# EAGLE schematic LauriFilter-R2 (EAGLE 6.5.0)
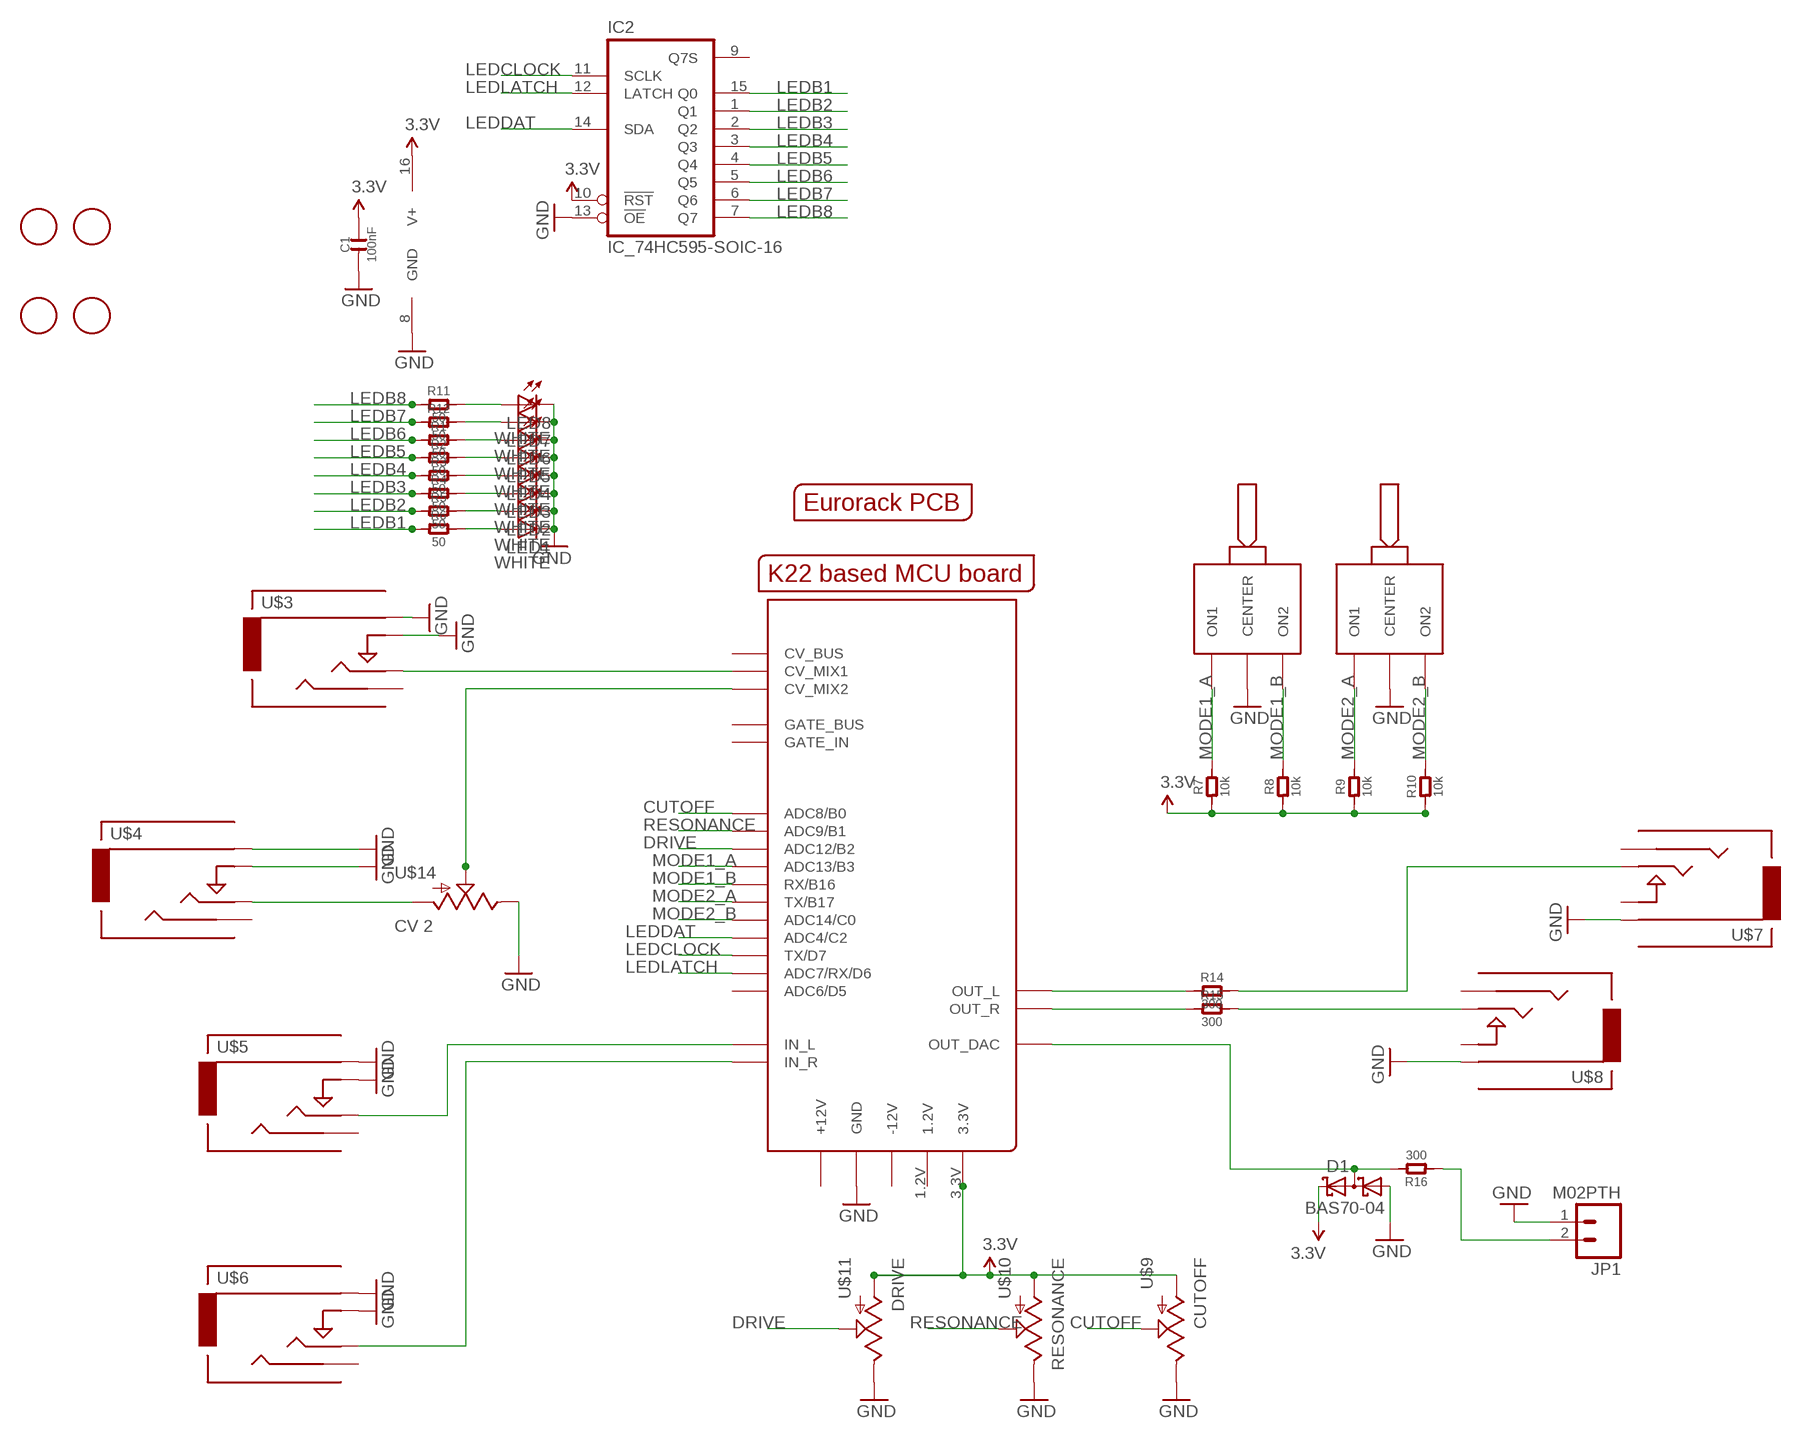
[diagram p0: schematic, sheet 1]

## Parts
C1  100nF  C-0603  [C0603]
D1  BAS70-04  [SOT23]
IC2  IC_74HC595-SOIC-16  [SOIC-16]
JP1  M02PTH  [1X02]
LED1  WHITE  LED3MM  [LED3MM]
LED2  WHITE  LED3MM  [LED3MM]
LED3  WHITE  LED3MM  [LED3MM]
LED4  WHITE  LED3MM  [LED3MM]
LED5  WHITE  LED3MM  [LED3MM]
LED6  WHITE  LED3MM  [LED3MM]
LED7  WHITE  LED3MM  [LED3MM]
LED8  WHITE  LED3MM  [LED3MM]
R1  50  R-0603  [R0603]
R2  50  R-0603  [R0603]
R3  50  R-0603  [R0603]
R4  50  R-0603  [R0603]
R5  50  R-0603  [R0603]
R6  50  R-0603  [R0603]
R7  10k  R-0603  [R0603]
R8  10k  R-0603  [R0603]
R9  10k  R-0603  [R0603]
R10  10k  R-0603  [R0603]
R11  50  R-0603  [R0603]
R12  50  R-0603  [R0603]
R14  300  R  [C0805]
R15  300  R  [C0805]
R16  300  R-0603  [R0603]
U$1  MCUBOARD  [MCUBASEBOARD]
U$2  EURORACK_PCB8HP  [EURORACK8HPPCB]
U$3  CV 1  AUDIO-JACKINPUT  [3.5MM-JACK-SWITCH-13MM-INPUT]
U$4  CV 2  AUDIO-JACKINPUT  [3.5MM-JACK-SWITCH-13MM-INPUT]
U$5  IN 1  AUDIO-JACKINPUT  [3.5MM-JACK-SWITCH-13MM-INPUT]
U$6  IN 2  AUDIO-JACKINPUT  [3.5MM-JACK-SWITCH-13MM-INPUT]
U$7  OUT 1  AUDIO-JACKOUTPUT  [3.5MM-JACK-SWITCH-13MM-OUTPUT]
U$8  OUT 2  AUDIO-JACKOUTPUT  [3.5MM-JACK-SWITCH-13MM-OUTPUT]
U$9  CUTOFF  POTZEPHPOT  [OG-POTS_ALPS_POT_VERTICAL]
U$10  RESONANCE  POTZEPHPOT  [OG-POTS_ALPS_POT_VERTICAL]
U$11  DRIVE  POTZEPHPOT  [OG-POTS_ALPS_POT_VERTICAL]
U$12  ONOFFON  [MULTICOMP1MS-ONOFFON]
U$13  ONOFFON  [MULTICOMP1MS-ONOFFON]
U$14  CV 2  POTZEPHPOT  [OG-POTS_ALPS_POT_VERTICAL]
U$15  FIDUCIAL  [FIDUCIAL_1MM]
U$16  FIDUCIAL  [FIDUCIAL_1MM]
U$17  FIDUCIAL  [FIDUCIAL_1MM]
U$18  FIDUCIAL  [FIDUCIAL_1MM]

## Nets
3.3V: C1.2 D1.2(C2) IC2.10(!RST) IC2.16(V+) R7.1 R8.1 R9.1 R10.1 U$1.3.3V U$9.P$3(A) U$10.P$3(A) U$11.P$3(A)
CUTOFF: U$1.ADC8(ADC8/B0) U$9.P$2(S)
DRIVE: U$1.ADC12(ADC12/B2) U$11.P$2(S)
GND: C1.1 D1.1(A1) IC2.8(GND) IC2.13(!OE) JP1.1 LED1.K(C) LED2.K(C) LED3.K(C) LED4.K(C) LED5.K(C) LED6.K(C) LED7.K(C) LED8.K(C) U$1.GND@1(GND) U$1.GND@2(GND) U$1.GND@4(GND) U$1.GND@5(GND) U$1.GND@6(GND) U$1.GND@7(GND) U$1.GND@8(GND) U$1.GND@9(GND) U$1.GND_BUS(GND) U$3.RING@1(RING) U$3.RING@2(RING) U$3.SWITCH@1(SWITCH) U$3.SWITCH@2(SWITCH) U$4.RING@1(RING) U$4.RING@2(RING) U$4.SWITCH@1(SWITCH) U$4.SWITCH@2(SWITCH) U$5.RING@1(RING) U$5.RING@2(RING) U$5.SWITCH@1(SWITCH) U$5.SWITCH@2(SWITCH) U$6.RING@1(RING) U$6.RING@2(RING) U$6.SWITCH@1(SWITCH) U$6.SWITCH@2(SWITCH) U$7.RING@1(RING) U$7.RING@2(RING) U$8.RING@1(RING) U$8.RING@2(RING) U$9.P$1(E) U$10.P$1(E) U$11.P$1(E) U$12.2(CENTER) U$13.2(CENTER) U$14.P$1(E)
LEDB1: IC2.15(Q0) R6.1
LEDB2: IC2.1(Q1) R5.1
LEDB3: IC2.2(Q2) R4.1
LEDB4: IC2.3(Q3) R3.1
LEDB5: IC2.4(Q4) R2.1
LEDB6: IC2.5(Q5) R1.1
LEDB7: IC2.6(Q6) R12.1
LEDB8: IC2.7(Q7) R11.1
LEDCLOCK: IC2.11(SCLK) U$1.TX/D7
LEDDAT: IC2.14(SDA) U$1.ADC4(ADC4/C2)
LEDLATCH: IC2.12(LATCH) U$1.ADC7(ADC7/RX/D6)
MODE1_A: R7.2 U$1.ADC13(ADC13/B3) U$12.1(ON1)
MODE1_B: R8.2 U$1.RX/B16 U$12.3(ON2)
MODE2_A: R9.2 U$1.TX/B17 U$13.1(ON1)
MODE2_B: R10.2 U$1.ADC14(ADC14/C0) U$13.3(ON2)
N$1: U$1.IN_L U$5.TIP@1(TIP) U$5.TIP@2(TIP)
N$2: U$1.IN_R U$6.TIP@1(TIP) U$6.TIP@2(TIP)
N$3: U$1.CV_MIX1 U$3.TIP@1(TIP) U$3.TIP@2(TIP)
N$4: U$1.CV_MIX2 U$14.P$2(S)
N$5: R14.2 U$7.TIP@1(TIP) U$7.TIP@2(TIP)
N$6: R15.2 U$8.TIP@1(TIP) U$8.TIP@2(TIP)
N$7: U$4.TIP@1(TIP) U$4.TIP@2(TIP) U$14.P$3(A)
N$8: LED1.A R6.2
N$9: LED2.A R5.2
N$11: R14.1 U$1.OUT_L
N$12: R15.1 U$1.OUT_R
N$13: D1.3(C1A2) R16.2 U$1.OUT_DAC
N$14: LED3.A R4.2
N$15: LED4.A R3.2
N$16: LED5.A R2.2
N$17: LED6.A R1.2
N$18: LED7.A R12.2
N$19: LED8.A R11.2
N$20: JP1.2 R16.1
RESONANCE: U$1.ADC9(ADC9/B1) U$10.P$2(S)
Unconnected: IC2.9(Q7S) U$1.1.2V U$1.+12V@1(+12V) U$1.+12V@2(+12V) U$1.-12V@1(-12V) U$1.-12V@2(-12V) U$1.ADC6(ADC6/D5) U$1.CVBUS(CV_BUS) U$1.GATE_BUS U$1.GATE_IN U$3.SECOND@1(SECOND) U$3.SECOND@2(SECOND) U$4.SECOND@1(SECOND) U$4.SECOND@2(SECOND) U$5.SECOND@1(SECOND) U$5.SECOND@2(SECOND) U$6.SECOND@1(SECOND) U$6.SECOND@2(SECOND) U$7.SECOND@1(SECOND) U$7.SECOND@2(SECOND) U$7.SWITCH@1(SWITCH) U$7.SWITCH@2(SWITCH) U$8.SECOND@1(SECOND) U$8.SECOND@2(SECOND) U$8.SWITCH@1(SWITCH) U$8.SWITCH@2(SWITCH)

## Library data of the parts
C1 = OPL:C*
D1 = diode:BAS70-04: Silicon Schottky Diodes General-purpose diode for high-speed switching
IC2 = dp_devices:IC_74HC595: 8-bit serial-in parallel out shift register, output latch 3-state
JP1 = SparkFun-Connectors:M02: Standard 2-pin 0.1" header. Use with - straight break away headers ( PRT-00116) - right angle break away headers (PRT-00553) - swiss pins (PRT-00743) - machine pins (PRT-00117) - female headers (PRT-00115) Molex polarized connector foot print use with: PRT-08233 with associated crimp pins and housings. 2.54_SCREWTERM for use with PRT-10571. 3.5mm Screw Terminal footprints for PRT-08084 5mm Screw Terminal footprints for use with PRT-08433
LED1-LED8 = SparkFun-LED:LED: LEDs Standard schematic elements and footprints for 5mm, 3mm, 1206, and 0603 sized LEDs. 5mm - Spark Fun Electronics SKU : COM-00529 (and others)
R1-R12 R14-R16 = OPL:R*
U$1 = EurorackModularParts:MCUBOARD
U$2 = EurorackModularParts:EURORACK_PCB
U$3-U$8 = EurorackModularParts:AUDIO-JACK: Switching Mono 3.5mm Audio Jack from Erthenvar.
U$9-U$11 U$14 = EurorackModularParts:POT
U$12 U$13 = EurorackModularParts:ONOFFON
U$15-U$18 = adafruit:FIDUCIAL: For use by pick and place machines to calibrate the vision/machine, 1mm By microbuilder.eu

## Net classes
0 default: width 0.203 mm